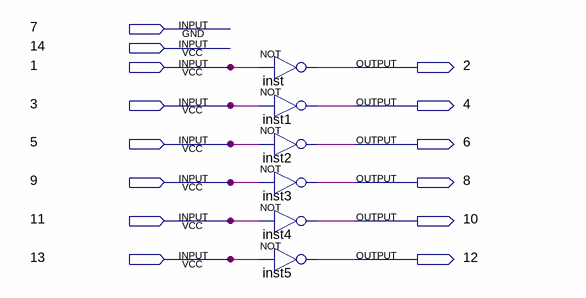
[diagram p0: schematic sheet]
// Quartus schematic 7404.bdf as structural Verilog: 6 symbols, 14 pins
module \7404  (
  input  \7 ,
  input  \14 ,
  input  \1 ,
  input  \3 ,
  input  \5 ,
  input  \9 ,
  input  \11 ,
  input  \13 ,
  output \2 ,
  output \4 ,
  output \6 ,
  output \8 ,
  output \10 ,
  output \12 
);

  not inst (\2 , \1 );
  not inst1 (\4 , \3 );
  not inst2 (\6 , \5 );
  not inst3 (\8 , \9 );
  not inst4 (\10 , \11 );
  not inst5 (\12 , \13 );
endmodule
